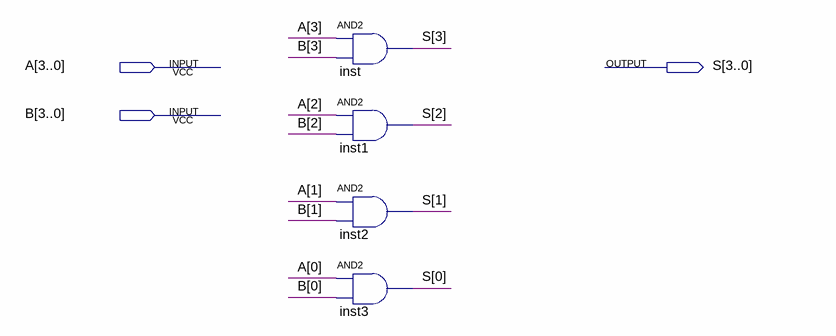
[diagram p0: schematic sheet]
// Quartus schematic and4bits.bdf as structural Verilog: 4 symbols, 3 pins
module and4bits (
  input  [3:0] A,
  input  [3:0] B,
  output [3:0] S
);

  and inst (S[3], A[3], B[3]);
  and inst1 (S[2], A[2], B[2]);
  and inst2 (S[1], A[1], B[1]);
  and inst3 (S[0], A[0], B[0]);
endmodule
